# Altium schematic sheet layout_test_slave1b.SchDoc
size B
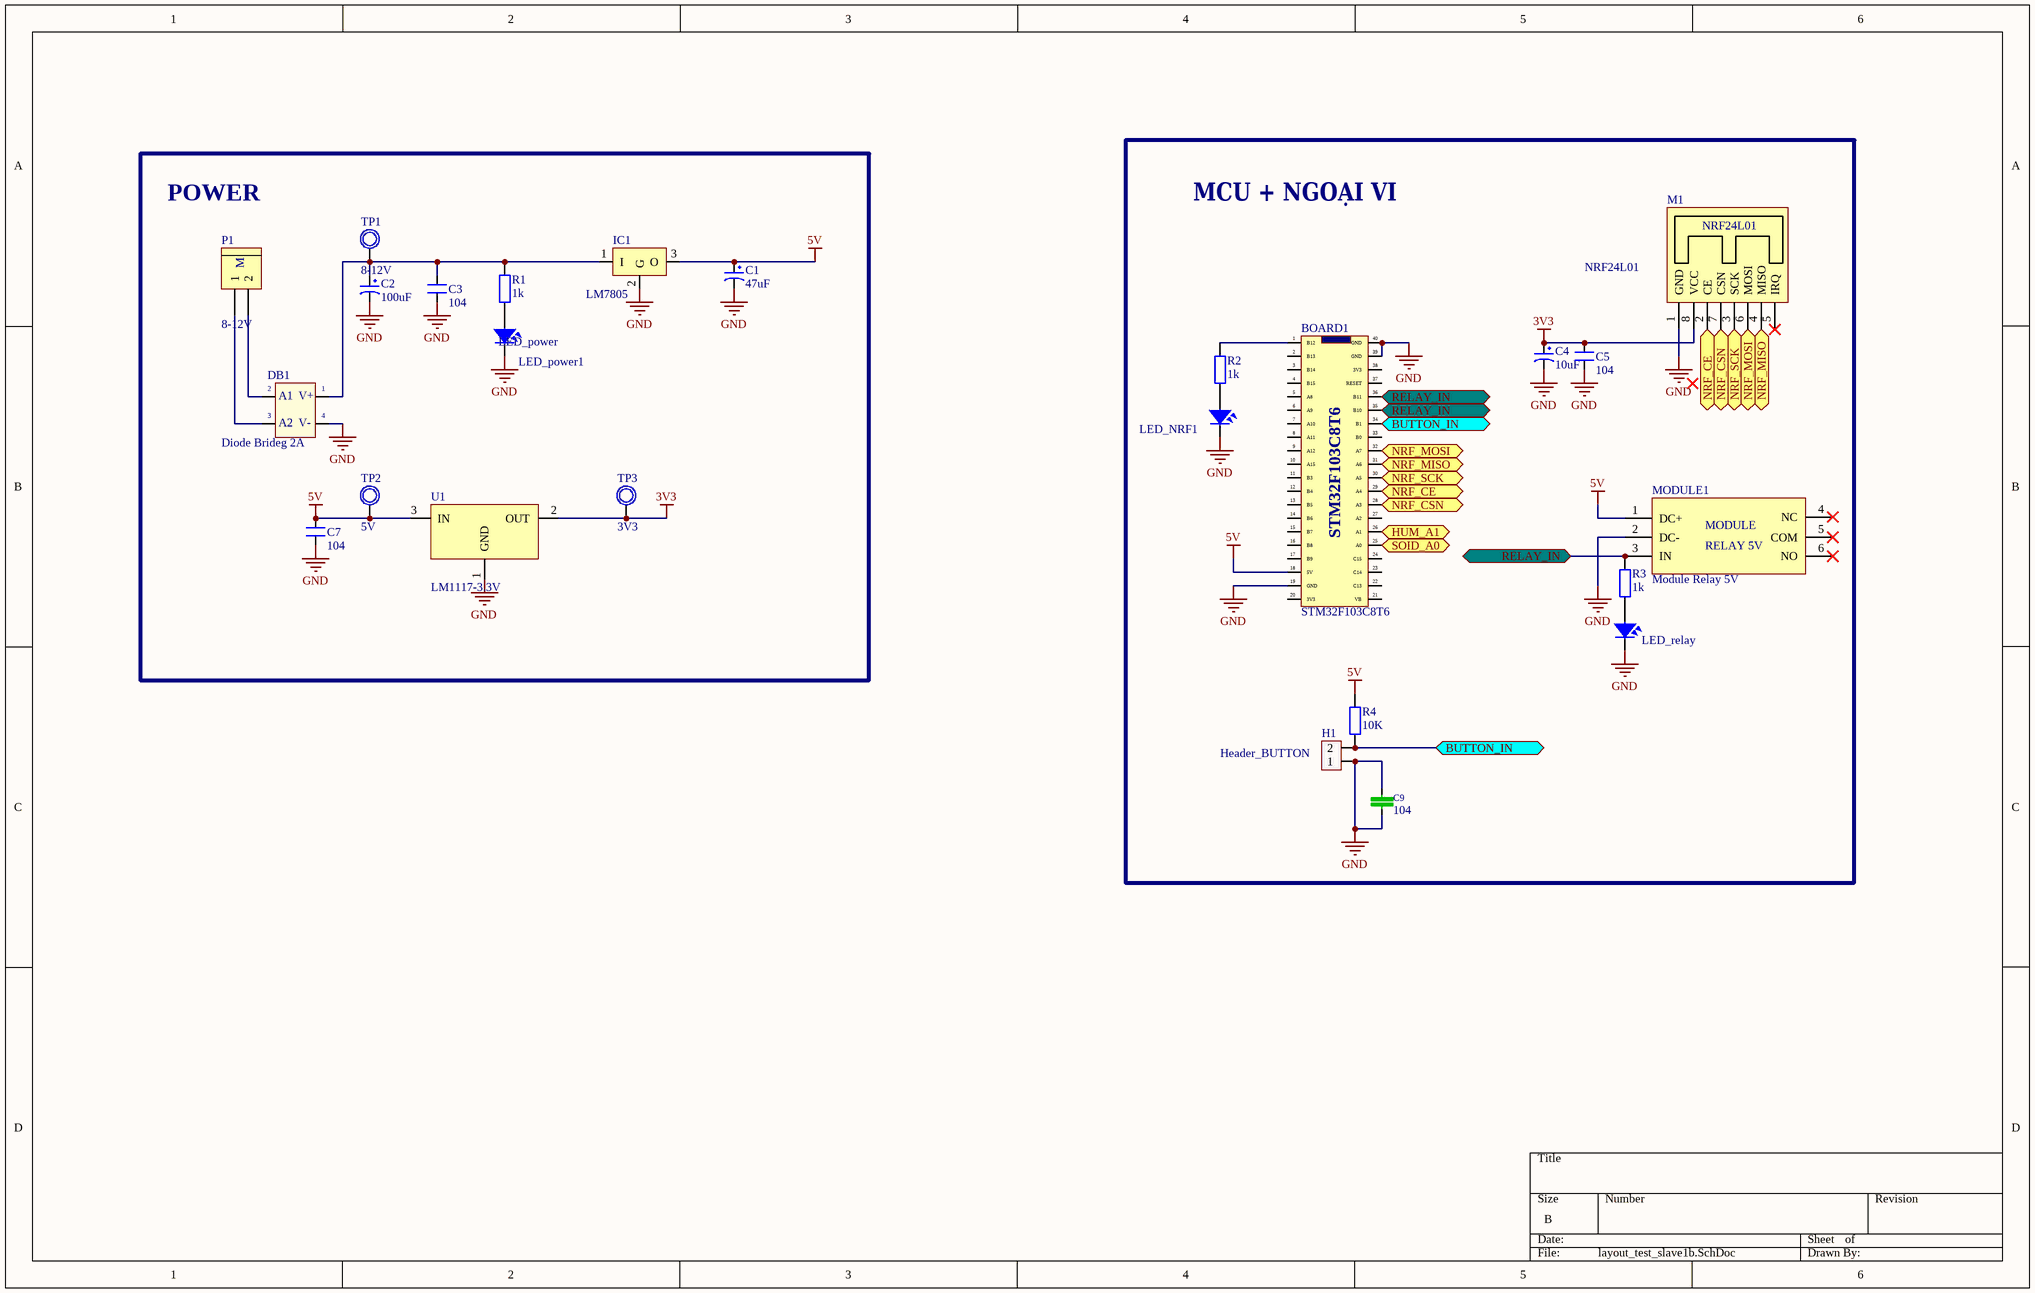
[diagram p0: layout_test_slave1b.SchDoc]

## Parts
BOARD1  STM32F103C8T6  [BOARD STM32F103C8T6 - duplicate]
C1  47uF  [CP1/2.5]
C2  100uF  [CP1/2.5]
C3  104  [SM-CAP-0805]
C4  10uF  [CP1/2]
C5  104  [SM-CAP-0805]
C7  104  [SM-CAP-0805]
C9  104  [C025-025,040]
DB1  Diode Brideg 2A  [DIO-Bri 2A]
H1  Header_BUTTON  [Header2]
IC1  LM7805  [TO252-123]
LED_NRF1  LED  [LED-5-BLUE]  (value not drawn)
LED_power1  LED_power  [LED-5-BLUE]
LED_relay  LED  [LED-5-BLUE]  (value not drawn)
M1  NRF24L01  [NRF24L01]
MODULE1  Module Relay 5V  [MODULE RELAY 5V]
P1  8-12V  [Medium - Header 2]
R1  1k  [R1/4W]
R2  1k  [R1/4W]
R3  1k  [R1/4W]
R4  10K  [R1/4W]
TP1  8-12V  [TP1]
TP2  5V  [TP1]
TP3  3V3  [TP1]
U1  LM1117-3.3V  [SOT223]

## Ports
BUTTON_IN, HUM_A1, NRF_CE, NRF_CSN, NRF_MISO, NRF_MOSI, NRF_SCK, RELAY_IN, SOID_A0

## Nets
3V3: C4.1 C5.2 M1.8(VCC) TP3.1 U1.2(OUT)
5V: BOARD1.18(5V) C1.1 C7.2 IC1.3(O) MODULE1.1(DC+) R4.2 TP2.1 U1.3(IN)
GND: BOARD1.19(GND) BOARD1.39(GND) BOARD1.40(GND) C1.2 C2.2 C3.1 C4.2 C5.1 C7.1 C9.1 C9.2 DB1.4(-V_OUT) H1.1 IC1.2(G) LED_NRF1.2 LED_power1.2 LED_relay.2 M1.1(GND) MODULE1.2(DC-) U1.1(GND)
BUTTON_IN: BOARD1.34(B1) H1.2 R4.1 ; port BUTTON_IN
HUM_A1: BOARD1.26(A1) ; port HUM_A1
NRF_CE: BOARD1.29(A4) M1.2(CE) ; port NRF_CE
NRF_CSN: BOARD1.28(A3) M1.7(CSN) ; port NRF_CSN
NRF_MISO: BOARD1.31(A6) M1.4(MISO) ; port NRF_MISO
NRF_MOSI: BOARD1.32(A7) M1.6(MOSI) ; port NRF_MOSI
NRF_SCK: BOARD1.30(A5) M1.3(SCK) ; port NRF_SCK
RELAY_IN: BOARD1.35(B10) BOARD1.36(B11) MODULE1.3(IN) R3.2 ; port RELAY_IN
SOID_A0: BOARD1.25(A0) ; port SOID_A0
NetBOARD1_1: BOARD1.1(B12) R2.2
NetC2_1: C2.1 C3.2 DB1.1(+V_OUT) IC1.1(I) R1.2 TP1.1
NetDB1_2: DB1.2(AC1) P1.2
NetDB1_3: DB1.3(AC2) P1.1
NetLED_NRF1_1: LED_NRF1.1 R2.1
NetLED_power1_1: LED_power1.1 R1.1
NetLED_relay_1: LED_relay.1 R3.1

Not connected (* = marked no-connect by the designer): BOARD1 2(B13) 3(B14) 4(B15) 5(A8) 6(A9) 7(A10) 8(A11) 9(A12) 10(A15) 11(B3) 12(B4) 13(B5) 14(B6) 15(B7) 16(B8) 17(B9) 20(3V3) 21(VB) 22(C13) 23(C14) 24(C15) 27(A2) 33(B0) 37(RESET) 38(3V3); M1 5(IRQ)*; MODULE1 4(NC)* 5(COM)* 6(NO)*

## Notes on the sheet
- POWER
- MCU + NGOẠI VI
- (in symbol DIODE BRIGDE) A1; V+; A2; V-
- (in symbol Header 2 - M) M
- (in symbol Module Relay 5V) MODULE; RELAY 5V

## Library data of the parts
BOARD1 = board stm32f103c8t6
C1 C2 = CP2: C 47uF/50V , 220uF/16V; Value: 47uF/16 - 50V; Description 1: 470uF/6,3V - 330uF/10V - 220uF/16V; Description 2: 100uF/25V - 35V - 47uF/50V - 22uF/100V; Description 3: 33uF => 47uF/63V - 1uF => 4,7uF/160V; Description 4: 1uF => 2,2uF/250V - 1uF/350V
C3 C5 C7 = CN: Value: 0,1uF/300V; Designed by: VanDungEvn
C4 = CP1: Cap P  0,1uF < 22uF , 16 - 50V; Value: 10uF/50V; Description 1: 10 => 220uF/6,3V/10V - 10uF => 100uF/16V; Description 2: 0,1uF => 33uF/50V - 10uF => 22uF/63V; Description 3: 0,47uF => 10uF/100V
C9 = CN: CAP CER 0.047UF 25V X7R 0402
DB1 = DIODE BRIGDE: Convert AC to DC voltage, 4 pin; Value: Cau 1A
H1 = Header2: Header IDC, 2 x 1 Pin Vertical 2.54mm Pitch (Non-Boxed, Male)
IC1 = LM78xx: Positive Voltage Regulator; Note: Tab is connected to pin 3 (GND).; Published: 24-Aug-2001; LatestRevisionDate: 17-Jul-2002; LatestRevisionNote: Re-released for DXP Platform.; DatasheetVersion: Apr-1994; PackageVersion: Jul-1998; PackageReference: ISOWATT220AB; Publisher: Altium Limited; PackageDescription: TO, Thru-Hole, Vertical, Heatsink Mounted; 3 In-Line Leads; Pitch 2.54 mm; Pin sequence 1, 3, 2; ComponentLink1Description: Manufacturer Link; ComponentLink1URL: http://www.st.com/; ComponentLink2Description: Datasheet; ComponentLink2URL: http://www.st.com/stonline/products/literature/ds/2146/l78m05c.pdf
LED_NRF1 LED_power1 LED_relay = LED: LED Single colour Green and Red; Value: LED 3 ly Single Colour
P1 = Header 2 - M: Header, 2-Pin, Medium; LatestRevisionDate: 17-Jul-2002; LatestRevisionNote: Re-released for DXP Platform.; Publisher: Altium Limited
R1-R4 = R1/4W: Resistor 1/4W; Value: R1/4W - 1K
TP1-TP3 = TP1: Test Point; Value: Test Point
U1 = LM1117: 800mA Low-Dropout Linear Regulator; Creator: Nguyen Ba Bien; Website: http://group3i.net